# EAGLE design wssf_arduino_nano_server (EAGLE 9.6.2)
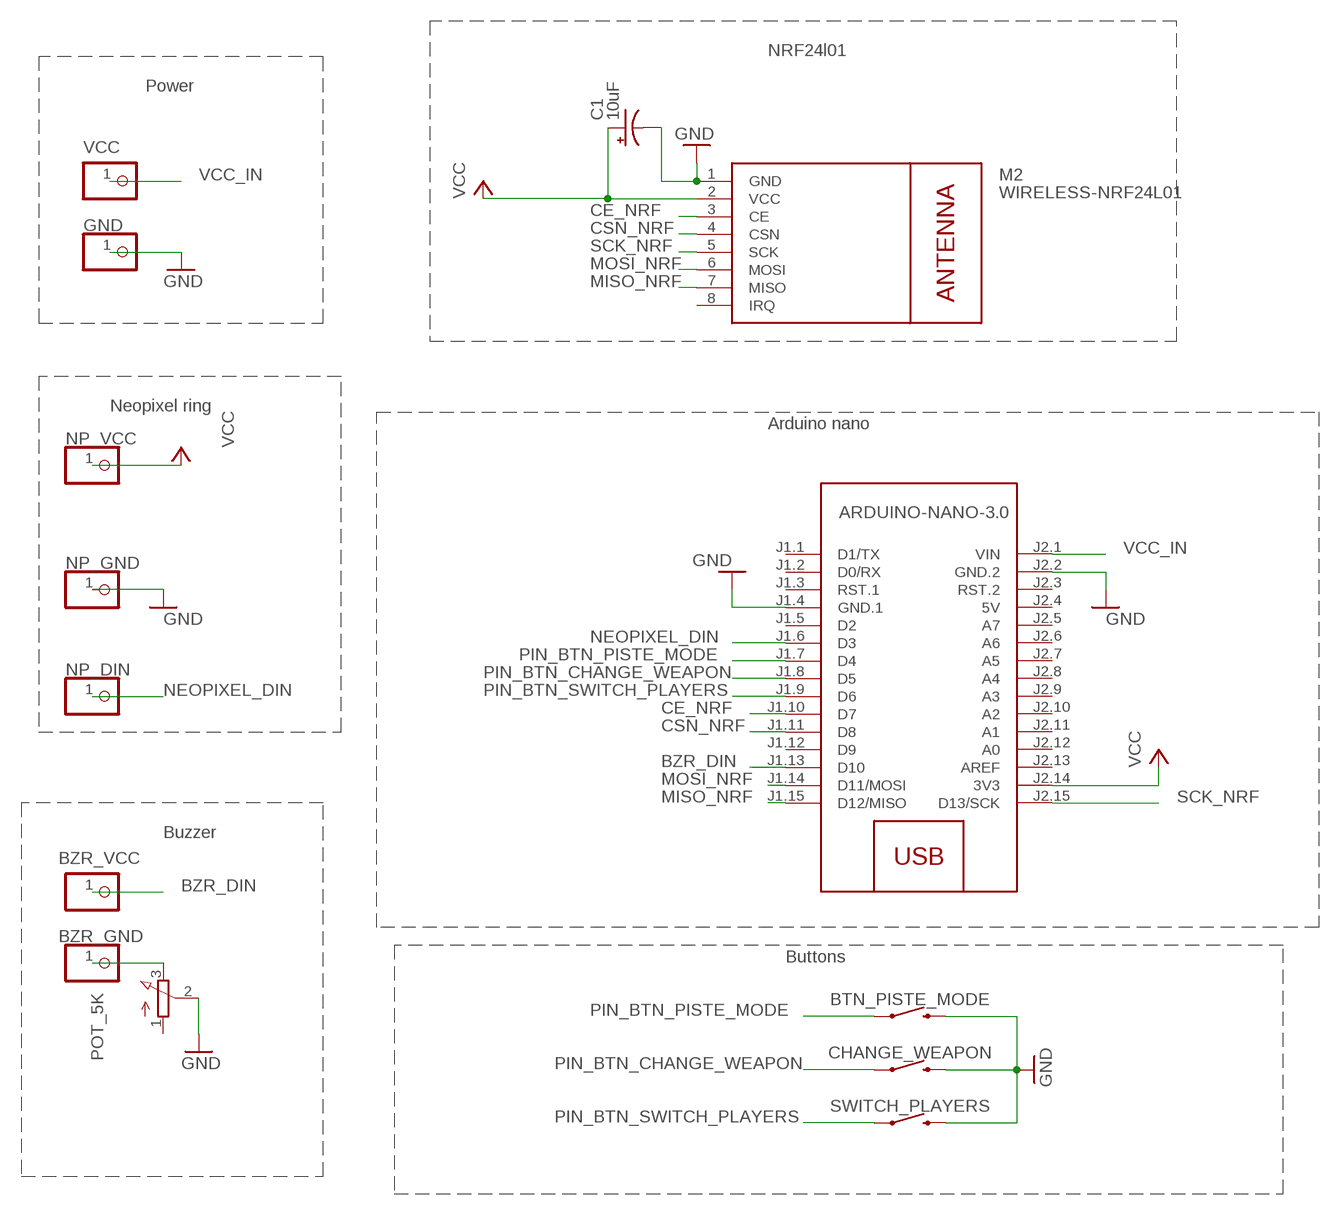
[diagram p0: schematic, sheet 1]

## Parts
BTN_PISTE_MODE  MOMENTARY-SWITCH-SPST-PTH-RIGHT-ANGLE-KIT  [TACTILE_SWITCH_PTH_RIGHT_ANGLE_KIT]
BZR_GND  BZR_GND  PINHD-1X1  [1X01]
BZR_VCC  BZR_VCC  PINHD-1X1  [1X01]
C1  10uF  CPOL-USE2-5  [E2-5]
CHANGE_WEAPON  MOMENTARY-SWITCH-SPST-PTH-RIGHT-ANGLE-KIT  [TACTILE_SWITCH_PTH_RIGHT_ANGLE_KIT]
GND  GND  PINHD-1X1  [1X01]
M1  ARDUINO-NANO-3.0  [ARDUINO-NANO-3.0]
M2  WIRELESS-NRF24L01  [WIRELESS-NRF24L01]
NP_DIN  NP_DIN  PINHD-1X1  [1X01]
NP_GND  NP_GND  PINHD-1X1  [1X01]
NP_VCC  NP_VCC  PINHD-1X1  [1X01]
POT_5K  3RP/1610N  [3RP/1610N]
SWITCH_PLAYERS  MOMENTARY-SWITCH-SPST-PTH-RIGHT-ANGLE-KIT  [TACTILE_SWITCH_PTH_RIGHT_ANGLE_KIT]
VCC  VCC  PINHD-1X1  [1X01]

## Nets
BZR_DIN: BZR_VCC.1 M1.J1.13(D10)
CE_NRF: M1.J1.10(D7) M2.3(CE)
CSN_NRF: M1.J1.11(D8) M2.4(CSN)
GND: BTN_PISTE_MODE.2 C1.- CHANGE_WEAPON.2 GND.1 M1.J1.4(GND.1) M1.J2.2(GND.2) M2.1(GND) NP_GND.1 POT_5K.2(S) SWITCH_PLAYERS.2
MISO_NRF: M1.J1.15(D12/MISO) M2.7(MISO)
MOSI_NRF: M1.J1.14(D11/MOSI) M2.6(MOSI)
N$1: BZR_GND.1 POT_5K.3(E)
NEOPIXEL_DIN: M1.J1.6(D3) NP_DIN.1
PIN_BTN_CHANGE_WEAPON: CHANGE_WEAPON.1 M1.J1.8(D5)
PIN_BTN_PISTE_MODE: BTN_PISTE_MODE.1 M1.J1.7(D4)
PIN_BTN_SWITCH_PLAYERS: M1.J1.9(D6) SWITCH_PLAYERS.1
SCK_NRF: M1.J2.15(D13/SCK) M2.5(SCK)
VCC: C1.+ M1.J2.14(3V3) M2.2(VCC) NP_VCC.1
VCC_IN: M1.J2.1(VIN) VCC.1
Unconnected: M1.J1.1(D1/TX) M1.J1.2(D0/RX) M1.J1.3(RST.1) M1.J1.5(D2) M1.J1.12(D9) M1.J2.3(RST.2) M1.J2.5(A7) M1.J2.6(A6) M1.J2.7(A5) M1.J2.8(A4) M1.J2.9(A3) M1.J2.10(A2) M1.J2.11(A1) M1.J2.12(A0) M1.J2.13(AREF) M2.8(IRQ) POT_5K.1(A)

## Notes on the sheet
- NRF24l01
- Power
- Neopixel ring
- Arduino nano
- Buzzer
- Buttons

## Power pins joined to a net without a drawn wire
5V: M1.J2.4(5V)

## Library data of the parts
BTN_PISTE_MODE CHANGE_WEAPON SWITCH_PLAYERS = SparkFun-Switches:MOMENTARY-SWITCH-SPST: Momentary Switch (Pushbutton) - SPST Normally-open (NO) SPST momentary switches (buttons, pushbuttons). Variants PTH-12MM - 12mm square, through-hole Momentary Pushbutton Switch - 12mm Square <https://www.sparkfun.com/products/9190> (COM-09190) PTH-6.0MM, PTH-6.0MM-KIT - 6.0mm square, through-hole Mini Pushbutton Switch <https://www.sparkfun.com/products/97> (COM-00097) KIT package intended for soldering kit's - only one side of pads' copper is exposed. PTH-RIGHT-ANGLE-KIT - Right-angle, through-hole Right Angle Tactile Button <https://www.sparkfun.com/products/10791> - Used on SparkFun BigTime Watch Kit <https://www.sparkfun.com/products/11734> SMD-12MM - 12mm square, surface-mount Tactile Button - SMD (12mm) <https://www.sparkfun.com/products/12993> (COM-12993) Used on SparkFun PicoBoard <https://www.sparkfun.com/products/11888> SMD-4.5MM - 4.5mm Square Trackball Switch Used on SparkFun Blackberry Trackballer Breakout <https://www.sparkfun.com/products/13169> SMD-4.6MMX2.8MM - 4.60mm x 2.80mm, surface mount Used on SparkFun SAMD21 Mini Breakout <https://www.sparkfun.com/products/13664> SMD-5.2MM, SMD-5.2-REDUNDANT - 5.2mm square, surface-mount Mini Pushbutton Switch - SMD <https://www.sparkfun.com/products/8720> (COM-08720) Used on Arduino Pro Mini <https://www.sparkfun.com/products/11114> REDUNDANT package connects both switch circuits together SMD-6.0X3.5MM - 6.0 x 3.5mm, surface mount Momentary Reset Switch SMD <https://www.sparkfun.com/products/8229> (COM-08229) SMD-6.2MM-TALL - 6.2mm square, surface mount Tactile Button - SMD (6mm) <https://www.sparkfun.com/products/12992> Used on SparkFun Digital Sandbox <https://www.sparkfun.com/products/12651> SMD-RIGHT-ANGLE - Right-angle, surface mount Used on SparkFun Block for Intel® Edison - Arduino <https://www.sparkfun.com/products/13036>; PROD_ID: CONN-10672; SF_SKU: COM-10791
BZR_GND BZR_VCC GND NP_DIN NP_GND NP_VCC VCC = pinhead:PINHD-1X1: PIN HEADER
C1 = rcl:CPOL-US: POLARIZED CAPACITOR, American symbol; SPICEPREFIX: C
M1 = wsff_lib:ARDUINO-NANO-3.0: Arduino Nano 3.0 and compatible devices More details available here: https://www.arduino.cc/en/Main/ArduinoBoardNano Click here to find device on ebay.com <http://www.ebay.com/sch/arduino+nano>
M2 = wsff_lib:WIRELESS-NRF24L01: 2.4 GHz Wireless Module based on NRF24L01 chip More details available here: http://www.electrodragon.com/w/NRF24L01 Click here to find device on ebay.com <http://www.ebay.com/sch/nrf24l01+arduino>
POT_5K = pot:3RP/1610N: 16mm Potentiometer one level Source: http://www.alphapotentiometers.net/html/16mm_pot_2.html

## Board
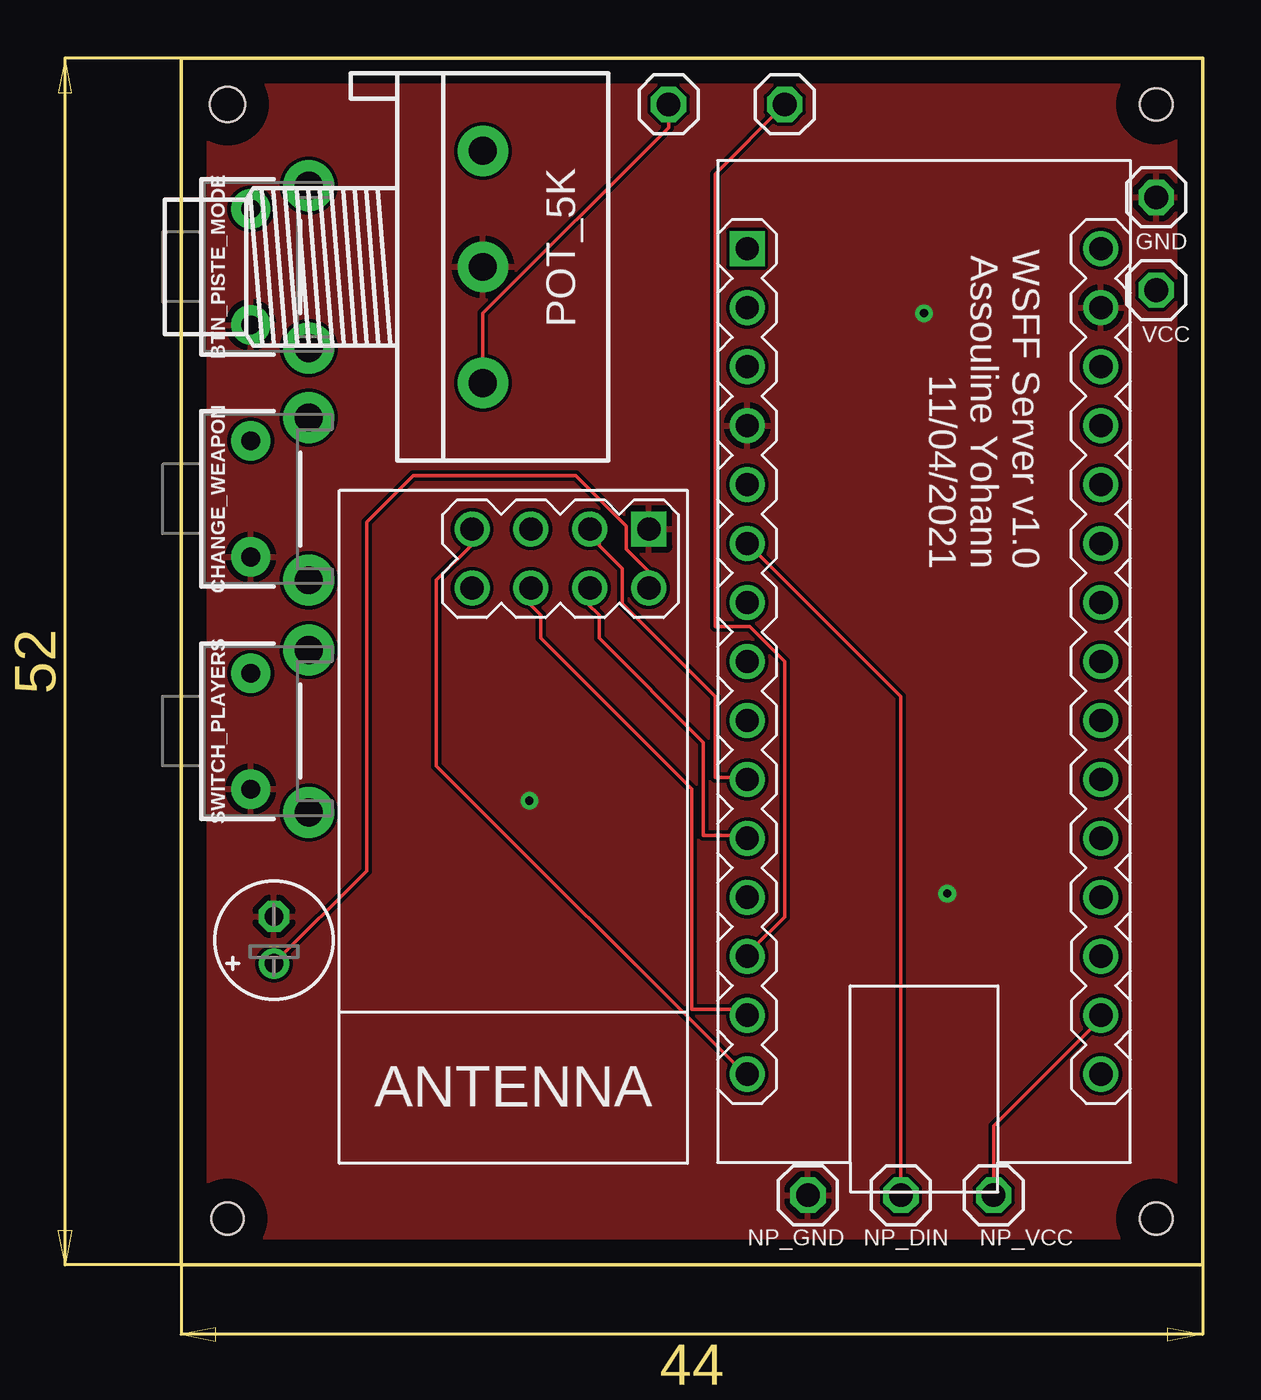
[diagram p1: board, top side]
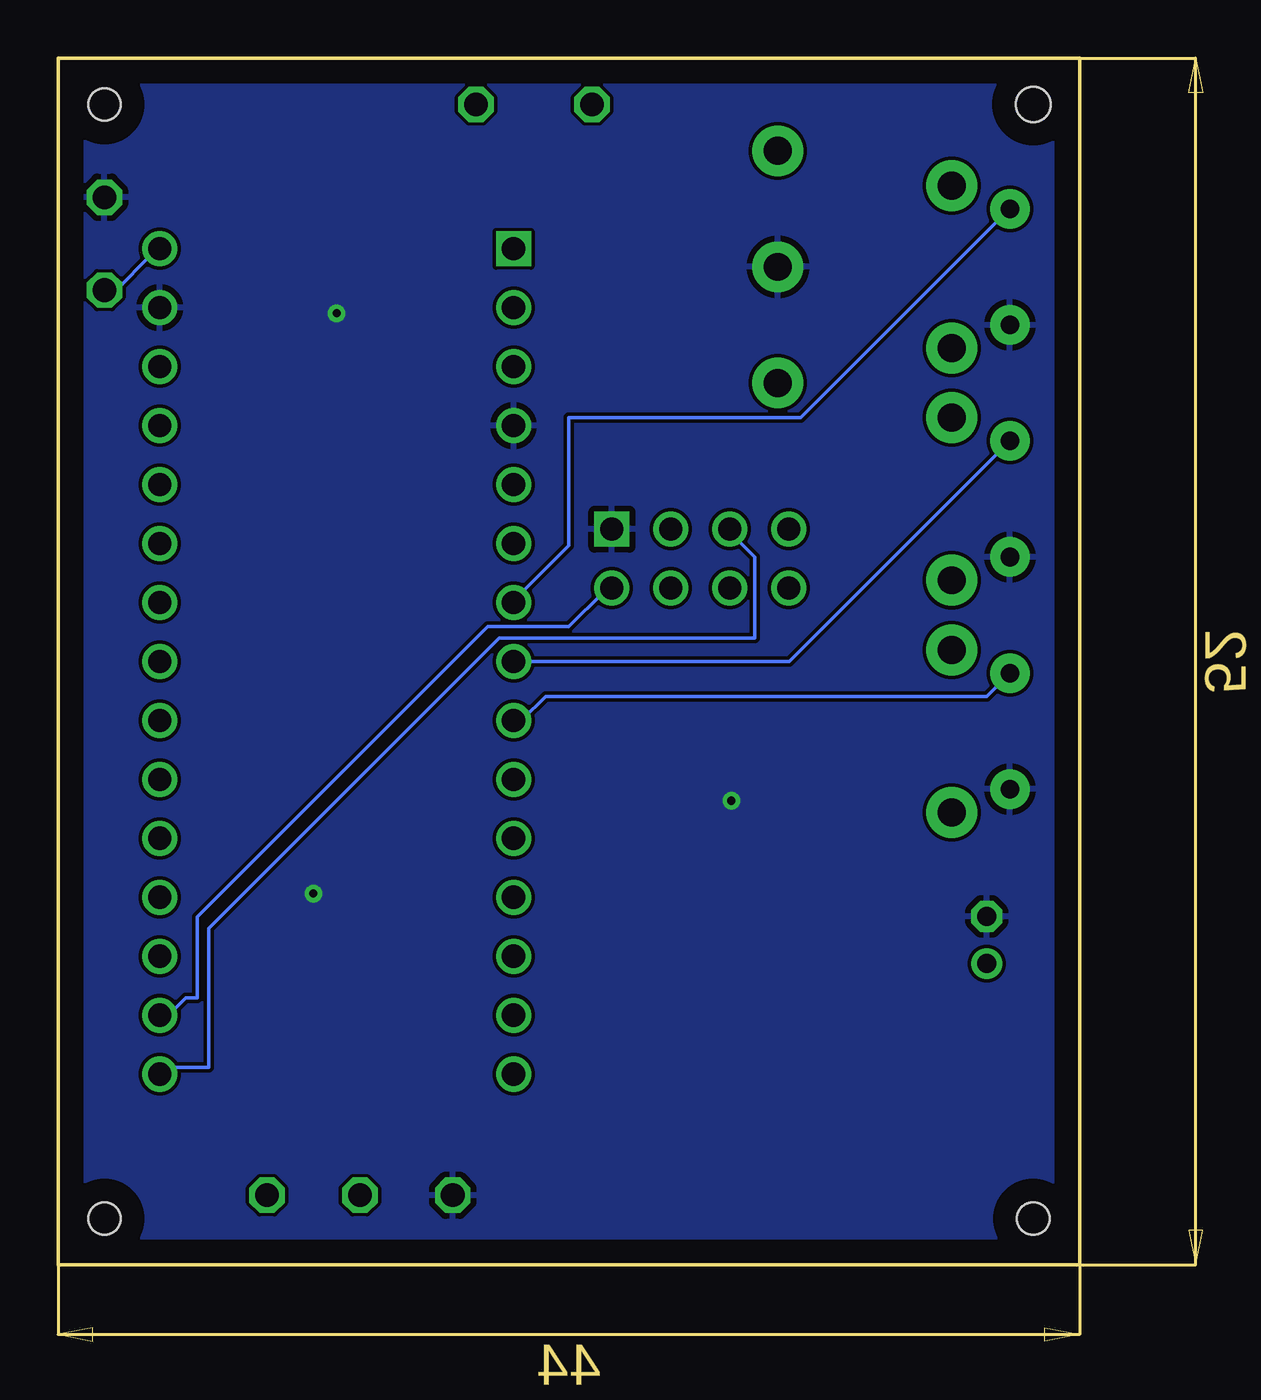
[diagram p2: board, bottom side, seen from below]

Size 44 x 52 mm. Coordinates in mm from the lower left corner, seen from the top.
Outline: 0,0 0,52 44,52 44,0 0,0
Copper layers (1*16): Top 0.035mm / dielectric 1.5mm / Bottom 0.035mm
Design rules "default": minimum track width 6mil, minimum drill 0.35mm, track to track 6mil, track to pad 6mil, pad to pad 6mil, via to via 6mil, smd to smd 6mil, copper to edge 40mil, drill to drill 6mil, minimum pad ring 10mil, minimum via ring 8mil, stop-mask expansion 4mil, vias tented up to drill 0mil, thermal gap 10mil
Holes 1.4 mm at 42,50 2,2 42,2
Holes 1.5 mm at 2,50

### Footprints (pad centres in the part's own frame; a part is rotated, then mirrored left to right if it is on the bottom)
TACTILE_SWITCH_PTH_RIGHT_ANGLE_KIT = drill 0.8 pad 1.7: 1 -2.5,0; 2 2.5,0 | drill 1.2 pad 2.2: ANCHOR1 -3.5,2.5; ANCHOR2 3.5,2.5
1X01 = drill 1.016 octagon: 1 0,0
E2-5 = drill 0.813 pad 1.27: + -1.016,0 | drill 0.813 pad 1.27 octagon: - 1.016,0
ARDUINO-NANO-3.0 = drill 1 square: J1.1 17.78,7.62 | drill 1: J1.2 15.24,7.62; J1.3 12.7,7.62; J1.4 10.16,7.62; J1.5 7.62,7.62; J1.6 5.08,7.62; J1.7 2.54,7.62; J1.8 0,7.62; J1.9 -2.54,7.62; J1.10 -5.08,7.62; J1.11 -7.62,7.62; J1.12 -10.16,7.62; J1.13 -12.7,7.62; J1.14 -15.24,7.62; J1.15 -17.78,7.62; J2.1 17.78,-7.62; J2.2 15.24,-7.62; J2.3 12.7,-7.62; J2.4 10.16,-7.62; J2.5 7.62,-7.62; J2.6 5.08,-7.62; J2.7 2.54,-7.62; J2.8 0,-7.62; J2.9 -2.54,-7.62; J2.10 -5.08,-7.62; J2.11 -7.62,-7.62; J2.12 -10.16,-7.62; J2.13 -12.7,-7.62; J2.14 -15.24,-7.62; J2.15 -17.78,-7.62
WIRELESS-NRF24L01 = drill 1 square: 1 -12.7,6.35 | drill 1: 2 -10.16,6.35; 3 -12.7,3.81; 4 -10.16,3.81; 5 -12.7,1.27; 6 -10.16,1.27; 7 -12.7,-1.27; 8 -10.16,-1.27
3RP/1610N = drill 1.2 pad 2.184: 1 -5,0; 2 0,0; 3 5,0

### Placement (x,y rotation side)
BTN_PISTE_MODE  3,43 270 top
BZR_GND  21,50 0 top
BZR_VCC  26,50 0 top
C1  4,14 90 top
CHANGE_WEAPON  3,33 270 top
GND  42,46 0 top
M1  32,26 90 top
M2  13.8,19 270 top
NP_DIN  31,3 0 top
NP_GND  27,3 0 top
NP_VCC  35,3 0 top
POT_5K  13,43 270 top
SWITCH_PLAYERS  3,23 270 top
VCC  42,42 0 top

### Tracks (layer width: path | path; a pad name or v marks a point on that pad's centre or on a via)
BZR_DIN
  Top 0.152: BZR_VCC.1 23,47 23,27.5 24.5,27.5 26,26 26,15 24.5,13.5 M1.J1.13
CE_NRF
  Top 0.152: M1.J1.10 24,21 23,21 23,24.5 19,28.5 19,30 18,31 18,31.5 M2.3
CSN_NRF
  Top 0.152: M1.J1.11 24,18.5 22.5,18.5 22.5,22.5 18,27 18,28 17.5,28.5 17.5,29 M2.4
GND  (via drill 0.35)
  other vias: 32,41 15,20 33,16
  pour Bottom: 0,0 0,52 44,52 44,0
  pour Top: 0,0 0,52 44,52 44,0
MISO_NRF
  Top 0.152: M1.J1.15 24,8.5 11,21.5 11,29.5 12.5,31 12.5,31.5 M2.7
MOSI_NRF
  Top 0.152: M1.J1.14 24,11 22,11 22,20.5 15.5,27 15.5,28 15,28.5 15,29 M2.6
N$1
  Top 0.152: BZR_GND.1 21,49 13,41 POT_5K.3
NEOPIXEL_DIN
  Top 0.152: NP_DIN.1 31,24.5 24.5,31 M1.J1.6
PIN_BTN_CHANGE_WEAPON
  Bottom 0.152: M1.J1.8 12.5,26 CHANGE_WEAPON.1
PIN_BTN_PISTE_MODE
  Bottom 0.152: BTN_PISTE_MODE.1 12,36.5 22,36.5 22,31 24,29 M1.J1.7
PIN_BTN_SWITCH_PLAYERS
  Bottom 0.152: SWITCH_PLAYERS.1 4,24.5 23,24.5 24,23.5 M1.J1.9
SCK_NRF
  Bottom 0.152: M2.5 15,31.5 14,30.5 14,27 25,27 37.5,14.5 37.5,8.5 39.5,8.5 M1.J2.15
VCC
  Top 0.152: NP_VCC.1 35,6 39.5,10.5 M1.J2.14 | C1.+ 8,16.98 8,32 10,34 17,34 19.17,31.83 19.17,30.85 20.15,29.87 M2.2
  Bottom 0.152: M2.2 20.5,29 22,27.5 25.5,27.5 38,15 38,11.5 38.5,11.5 39,11 39.5,11 M1.J2.14
VCC_IN
  Bottom 0.152: VCC.1 41.5,42 40,43.5 M1.J2.1

### Text on the board
tPlace: WSFF Server v1.0 / Assouline Yohann / 11/04/2021